# EAGLE schematic Skematik (EAGLE 9.6.2)
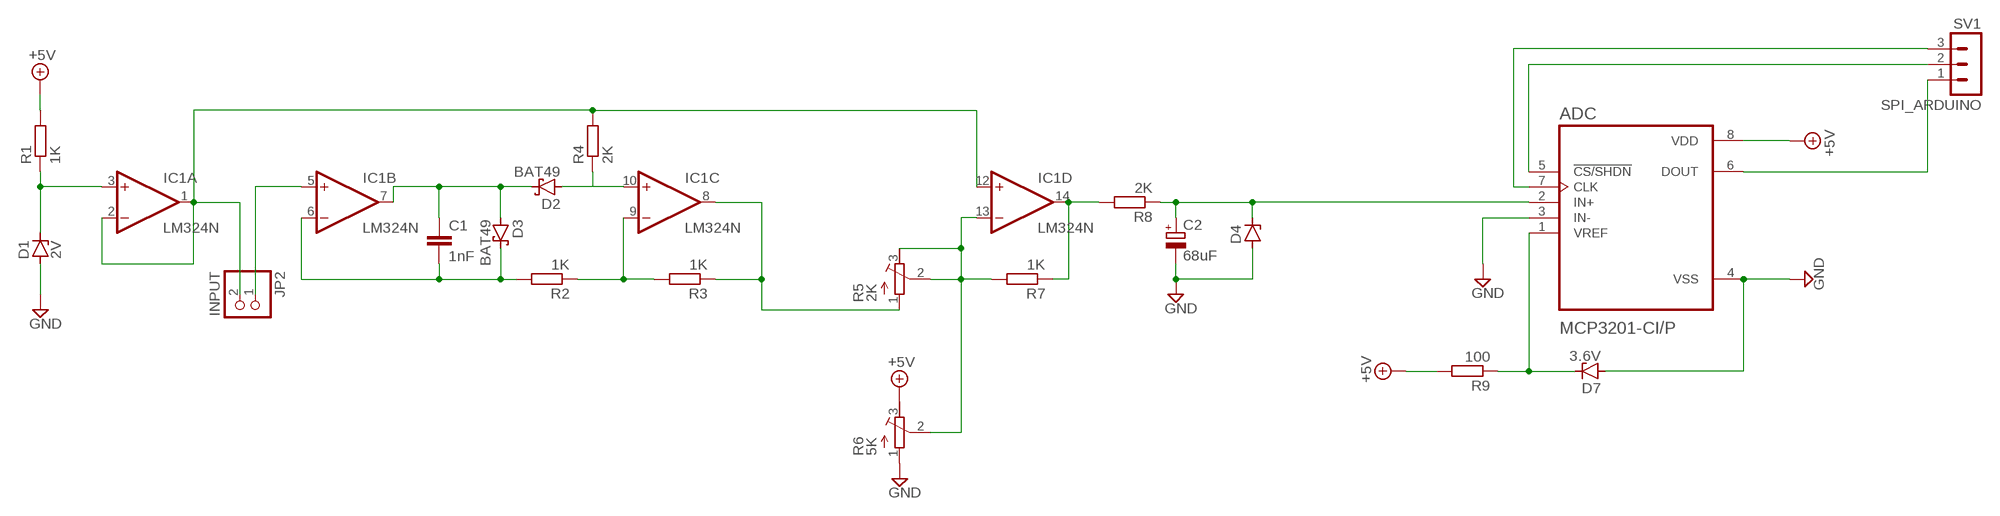
[diagram p0: schematic, sheet 1]

## Parts
ADC  MCP3201-CI/P  [DIP787W46P254L927H533Q8]
C1  1nF  C-EU025-025X050  [C025-025X050]
C2  68uF  CPOL-EUE2-4  [E2-4]
D1  2V  ZENER-DIODEZD-2.5  [ZDIO-2.5]
D2  BAT49  [DO41-10]
D3  BAT49  [DO41-10]
D4  ZENER-DIODEZD-2.5  [ZDIO-2.5]
D7  3.6V  ZENER-DIODEZD-2.5  [ZDIO-2.5]
IC1  LM324N  [DIL14]
JP2  INPUT  PINHD-1X2  [1X02]
R1  1K  R-EU_0204/7  [0204/7]
R2  1K  R-EU_0204/7  [0204/7]
R3  1K  R-EU_0204/7  [0204/7]
R4  2K  R-EU_0204/7  [0204/7]
R5  2K  R-TRIMM64P  [RTRIM64P]
R6  5K  R-TRIMM64P  [RTRIM64P]
R7  1K  R-EU_0204/7  [0204/7]
R8  2K  R-EU_0204/7  [0204/7]
R9  100  R-EU_0204/7  [0204/7]
SV1  SPI_ARDUINO  MA03-1  [MA03-1]

## Nets
+5V: ADC.8(VDD) R1.2 R6.3(E) R9.2
GND: ADC.3(IN-) ADC.4(VSS) C2.- D1.A D4.A D7.A R6.1(A)
N$1: D1.C IC1.3(A:+IN) R1.1
N$2: IC1.1(A:OUT) IC1.2(A:-IN) IC1.12(D:+IN) JP2.2 R4.2
N$3: D2.A IC1.10(C:+IN) R4.1
N$4: C1.1 D2.C D3.A IC1.7(B:OUT)
N$5: C1.2 D3.C IC1.6(B:-IN) R2.2
N$6: IC1.9(C:-IN) R2.1 R3.2
N$7: IC1.8(C:OUT) R3.1 R5.1(A)
N$9: IC1.13(D:-IN) R5.2(S) R5.3(E) R6.2(S) R7.2
N$10: ADC.2(IN+) C2.+ D4.C R8.1
N$12: IC1.5(B:+IN) JP2.1
N$13: ADC.5(!CS/SHDN) SV1.2
N$14: ADC.7(CLK) SV1.3
N$15: ADC.6(DOUT) SV1.1
N$16: ADC.1(VREF) D7.C R9.1
OUT: IC1.14(D:OUT) R7.1 R8.2

## Power pins joined to a net without a drawn wire
V+: IC1.4(P:V+)
V-: IC1.11(P:V-)

## Library data of the parts
ADC = MCP3201-CI_P:MCP3201-CI/P: Check prices <https://pricing.snapeda.com/parts/MCP3201-CI/P/Microchip/view-part?ref=eda>; AVAILABILITY: In Stock; DESCRIPTION: 12 Bit Analog to Digital Converter 1 Input 1 SAR 8-PDIP; MF: Microchip; MP: MCP3201-CI/P; PACKAGE: DIP-8 Microchip; PRICE: None; PURCHASE-URL: https://pricing.snapeda.com/search/part/MCP3201-CI/P/?ref=eda
C1 = rcl:C-EU: CAPACITOR, European symbol; SPICEPREFIX: C
C2 = rcl:CPOL-EU: POLARIZED CAPACITOR, European symbol; SPICEPREFIX: C
D1 D4 D7 = diode:ZENER-DIODE: Z-Diode
D2 D3 = diode:BAT49: DIODE small signal diode
IC1 = linear:LM324: OP AMP
JP2 = pinhead:PINHD-1X2: PIN HEADER
R1-R4 R7-R9 = rcl:R-EU_: RESISTOR, European symbol; SPICEPREFIX: R
R5 R6 = rcl:R-TRIMM: Trimm resistor; SPICEMODEL: X; SPICEPREFIXL: POT
SV1 = con-lstb:MA03-1: PIN HEADER; OC_FARNELL: unknown; OC_NEWARK: unknown